# Altium schematic sheet LCD&Joystick.SchDoc
size A4; Revision: D.1(PCB.SCH)
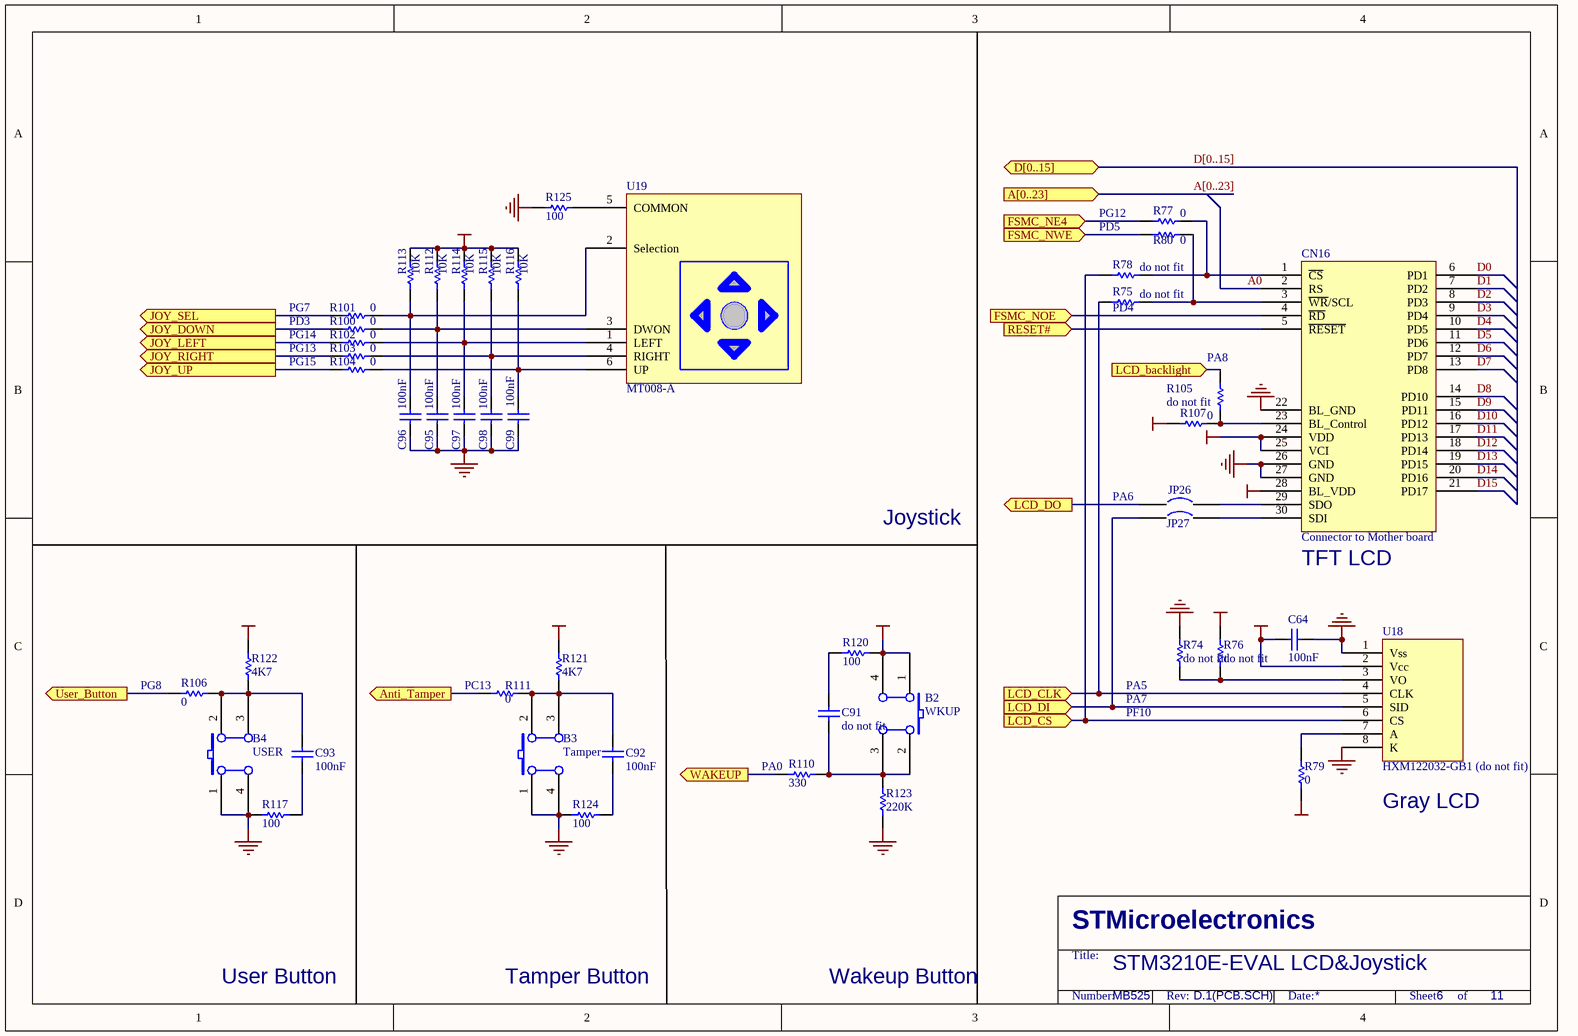
[diagram p0: LCD&Joystick.SchDoc]

## Parts
B2  WKUP  [PB10]
B3  Tamper  [PB10]
B4  USER  [PB10]
C64  100nF  [0603P]
C91  do not fit  [0603P]
C92  100nF  [0603P]
C93  100nF  [0603P]
C95  100nF  [0603P]
C96  100nF  [0603P]
C97  100nF  [0603P]
C98  100nF  [0603P]
C99  100nF  [0603P]
CN16  Connector to Mother board  [AM240320A]
JP26  (no value)  [SPST-2]
JP27  (no value)  [SPST-2]
R74  do not fit  [0603]
R75  do not fit  [0603]
R76  do not fit  [0603]
R77  0  [0603]
R78  do not fit  [0603]
R79  0  [0603]
R80  0  [0603]
R100  0  [0805]
R101  0  [0805]
R102  0  [0805]
R103  0  [0805]
R104  0  [0805]
R105  do not fit  [0603]
R106  0  [0805]
R107  0  [0603]
R110  330  [0805]
R111  0  [0805]
R112  10K  [0603]
R113  10K  [0603]
R114  10K  [0603]
R115  10K  [0603]
R116  10K  [0603]
R117  100  [0603]
R120  100  [0603]
R121  4K7  [0603]
R122  4K7  [0603]
R123  220K  [0603]
R124  100  [0603]
R125  100  [0603]
U18  HXM122032-GB1 (do not fit)  [LCD12232-GB1]
U19  MT008-A  [JOY]

## Ports
A[0..23] (in), Anti_Tamper (out), D[0..15] (bidir), FSMC_NE4 (in), FSMC_NOE (in), FSMC_NWE (in), JOY_DOWN (out), JOY_LEFT (out), JOY_RIGHT (out), JOY_SEL (out), JOY_UP (out), LCD_backlight (in), LCD_CLK (in), LCD_CS (in), LCD_DI (in), LCD_DO (out), RESET# (in), User_Button (out), WAKEUP (out)

## Nets
+3V3: B2.1(A0) B2.4(A1) C64.1 CN16.24(VDD) CN16.25(VCI) CN16.28(BL_VDD) R76.2 R107.2 R112.2 R113.1 R114.2 R115.2 R116.2 R120.1 R121.2 R122.2 U18.2(Vcc)
+5V: R79.1
GND: B3.1(A0) B3.4(A1) B4.1(A0) B4.4(A1) C64.2 C95.1 C96.1 C97.1 C98.1 C99.1 CN16.22(BL_GND) CN16.26(GND) CN16.27(GND) R74.1 R117.1 R123.2 R124.1 R125.1 U18.1(Vss) U18.8(K)
A0: CN16.2(RS)
Anti_Tamper: R111.2 ; port Anti_Tamper
D0: CN16.6(PD1)
D1: CN16.7(PD2)
D2: CN16.8(PD3)
D3: CN16.9(PD4)
D4: CN16.10(PD5)
D5: CN16.11(PD6)
D6: CN16.12(PD7)
D7: CN16.13(PD8)
D8: CN16.14(PD10)
D9: CN16.15(PD11)
D10: CN16.16(PD12)
D11: CN16.17(PD13)
D12: CN16.18(PD14)
D13: CN16.19(PD15)
D14: CN16.20(PD16)
D15: CN16.21(PD17)
FSMC_NE4: R77.1 ; port FSMC_NE4
FSMC_NOE: CN16.4(~{RD}) ; port FSMC_NOE
FSMC_NWE: R80.1 ; port FSMC_NWE
JOY_DOWN: R100.2 ; port JOY_DOWN
JOY_LEFT: R102.2 ; port JOY_LEFT
JOY_RIGHT: R103.2 ; port JOY_RIGHT
JOY_SEL: R101.2 ; port JOY_SEL
JOY_UP: R104.2 ; port JOY_UP
LCD_backlight: R105.2 ; port LCD_backlight
LCD_CLK: R75.2 U18.4(CLK) ; port LCD_CLK
LCD_CS: R78.1 U18.6(CS) ; port LCD_CS
LCD_DI: JP27.1 U18.5(SID) ; port LCD_DI
LCD_DO: JP26.1 ; port LCD_DO
RESET#: CN16.5(~{RESET}) ; port RESET#
User_Button: R106.2 ; port User_Button
WAKEUP: R110.2 ; port WAKEUP
NetB2_2: B2.2(B0) B2.3(B1) C91.2 R110.1 R123.1
NetB3_2: B3.2(B0) B3.3(B1) C92.2 R111.1 R121.1
NetB4_2: B4.2(B0) B4.3(B1) C93.2 R106.1 R122.1
NetC91_1: C91.1 R120.2
NetC92_1: C92.1 R124.2
NetC93_1: C93.1 R117.2
NetC95_2: C95.2 R100.1 R112.1 U19.3(DWON)
NetC96_2: C96.2 R101.1 R113.2 U19.2(Selection)
NetC97_2: C97.2 R102.1 R114.1 U19.1(LEFT)
NetC98_2: C98.2 R103.1 R115.1 U19.4(RIGHT)
NetC99_2: C99.2 R104.1 R116.1 U19.6(UP)
NetCN16_1: CN16.1(~{CS}) R77.2 R78.2
NetCN16_3: CN16.3(~{WR}/SCL) R75.1 R80.2
NetCN16_23: CN16.23(BL_Control) R105.1 R107.1
NetCN16_29: CN16.29(SDO) JP26.2
NetCN16_30: CN16.30(SDI) JP27.2
NetR74_2: R74.2 R76.1 U18.3(VO)
NetR79_2: R79.2 U18.7(A)
NetR125_2: R125.2 U19.5(COMMON)

## Buses and harness runs
bus A[0..23] = port A[0..23]
bus D[0..15] = port D[0..15]

## Notes on the sheet
- PG12
- PD5
- PG7
- (near R75) PD4
- PD3
- PG14
- PG13
- PG15
- (near R105) PA8
- PA6
- Joystick
- (near CN16) TFT LCD
- (near R106) PG8
- (near R111) PC13
- (near R74) PA5
- (near R74) PA7
- (near R74) PF10
- (near R110) PA0
- (near U18) Gray LCD
- User Button
- Tamper Button
- Wakeup Button
- STM3210E-EVAL LCD&Joystick
- MB525
- 6
- 11
- STMicroelectronics
- Title:
- Number:
- Rev:
- Date:
- Sheet       of

## Library data of the parts
B2-B4 = SW PUSHBUTTON: SE PUSHBUTTON
C64 C91-C93 C95-C99 = CAP: Capacitor; Value: 100pF; Published: 8-Jun-2000; Revision: July-2002: Re-released for DXP Platform.; Publisher: Altium Limited
CN16 = ColorLCD_module
JP26 JP27 = Circuit Breaker: Published: 24-Mar-1999; Revision: July-2002: Re-released for DXP Platform.; Publisher: Altium Limited
R74-R80 R100-R107 R110-R117 R120 R124 R125 = Res1: Resistor; Value: 1K; Published: 8-Jun-2000; Revision: July-2002: Re-released for DXP Platform.; Publisher: Altium Limited
R121-R123 = res1: Resistor; Value: 1K; Published: 8-Jun-2000; Revision: July-2002: Re-released for DXP Platform.; Publisher: Altium Limited
U18 = HXM122032-GB1
U19 = MT-008A